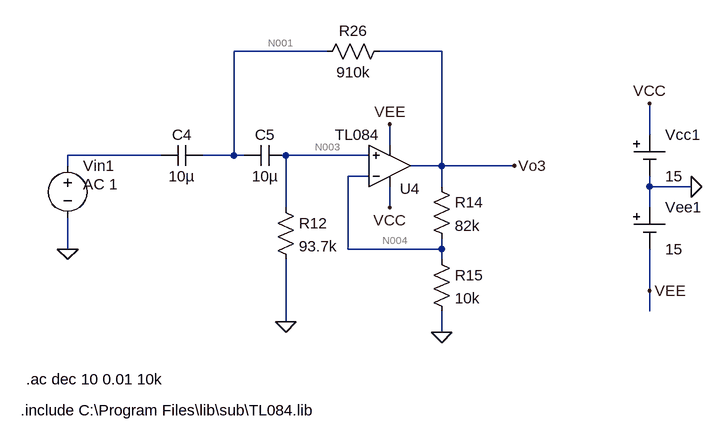
[diagram p0: schematic HPF.asc]
HPF.asc, the LTspice schematic file:
Version 4
SHEET 1 2944 1664
WIRE -768 -304 -912 -304
WIRE -592 -304 -688 -304
WIRE -272 -176 -272 -224
WIRE -672 -160 -672 -192
WIRE -1024 -144 -1168 -144
WIRE -912 -144 -912 -304
WIRE -912 -144 -960 -144
WIRE -896 -144 -912 -144
WIRE -704 -144 -832 -144
WIRE -1168 -128 -1168 -144
WIRE -592 -128 -592 -304
WIRE -592 -128 -640 -128
WIRE -480 -128 -592 -128
WIRE -704 -112 -736 -112
WIRE -592 -96 -592 -128
WIRE -272 -96 -272 -112
WIRE -208 -96 -272 -96
WIRE -832 -64 -832 -144
WIRE -672 -64 -672 -96
WIRE -272 -64 -272 -96
WIRE -1168 0 -1168 -48
WIRE -736 0 -736 -112
WIRE -592 0 -592 -16
WIRE -592 0 -736 0
WIRE -592 16 -592 0
WIRE -272 64 -272 0
WIRE -272 96 -272 64
WIRE -832 112 -832 16
WIRE -592 128 -592 96
FLAG -208 -96 0
FLAG -272 -224 VCC
FLAG -272 64 VEE
FLAG -1168 0 0
FLAG -832 112 0
FLAG -592 128 0
FLAG -672 -192 VEE
FLAG -672 -64 VCC
FLAG -480 -128 Vo3
SYMBOL Misc\\cell -272 -176 R0
SYMATTR InstName Vcc1
SYMATTR Value 15
SYMBOL Misc\\cell -272 -64 R0
SYMATTR InstName Vee1
SYMATTR Value 15
SYMBOL voltage -1168 -144 R0
WINDOW 123 24 44 Left 2
WINDOW 39 0 0 Left 0
SYMATTR Value2 AC 1
SYMATTR InstName Vin1
SYMATTR Value ""
SYMBOL cap -832 -160 R90
WINDOW 0 0 32 VBottom 2
WINDOW 3 32 32 VTop 2
SYMATTR InstName C5
SYMATTR Value 10µ
SYMBOL cap -960 -160 R90
WINDOW 0 0 32 VBottom 2
WINDOW 3 32 32 VTop 2
SYMATTR InstName C4
SYMATTR Value 10µ
SYMBOL res -608 -112 R0
SYMATTR InstName R14
SYMATTR Value 82k
SYMBOL res -608 0 R0
SYMATTR InstName R15
SYMATTR Value 10k
SYMBOL res -672 -320 R90
WINDOW 0 0 56 VBottom 2
WINDOW 3 32 56 VTop 2
SYMATTR InstName R26
SYMATTR Value 910k
SYMBOL Opamps\\opamp2 -672 -64 M180
WINDOW 0 16 29 Left 2
WINDOW 3 -84 112 Left 2
SYMATTR InstName U4
SYMATTR Value TL084
SYMBOL res -848 -80 R0
SYMATTR InstName R12
SYMATTR Value 93.7k
TEXT -1232 200 Left 2 !.ac dec 10 0.01 10k
TEXT -1240 248 Left 2 !.include C:\\Program Files\\lib\\sub\\TL084.lib

The netlist it stands for:
* HPF.asc
Vcc1 VCC 0 15
Vee1 0 VEE 15
Vin1 N002 0 AC 1
C5 N003 N001 10µ
C4 N001 N002 10µ
R14 Vo3 N004 82k
R15 N004 0 10k
R26 Vo3 N001 910k
XU4 N003 N004 VCC VEE Vo3 TL084  ; pins In+ In- V+ V- OUT
R12 N003 0 93.7k
.ac dec 10 0.01 10k
.include C:\Program Files\lib\sub\TL084.lib
.backanno
.end

* Results of the author's LTspice run, read from the files saved beside the schematic
* Operating Point, zero values left out:
*   V(vcc) = 15 V
*   V(vee) = -15 V
*   V(n003) = -4.221 µV
*   V(n001) = 65.79 µV
*   V(vo3) = 65.79 µV
*   V(n004) = 6.749 µV
*   I(R12) = -45.05 pA
*   I(R15) = 674.9 pA
*   I(R14) = 720 pA
*   I(Vee1) = -14.19 mA
*   I(Vcc1) = -14.19 mA
*   Ix(u4:1) = 45.05 pA
*   Ix(u4:2) = 45.05 pA
*   Ix(u4:3) = 14.19 mA
*   Ix(u4:4) = -14.19 mA
*   Ix(u4:5) = -720 pA
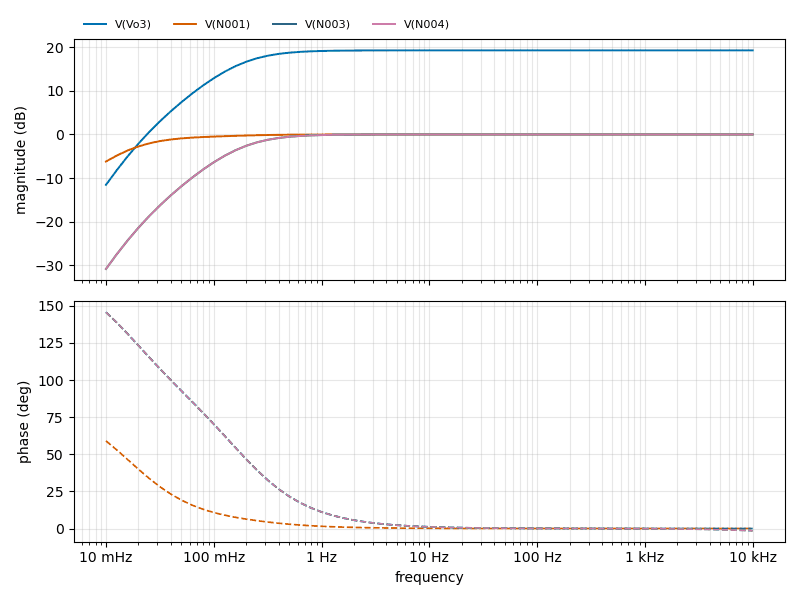
[diagram p1: AC Analysis of HPF.asc, plotted from the saved traces]
* AC Analysis, 1 run:
*   V(Vo3): -11.55 dB at 10 mHz, 19.27 dB at 10 kHz, peak 19.28 dB at 251.2 Hz, 3 dB below the peak at 182.5 mHz
*   V(N001): -6.21 dB at 10 mHz, -0.00 dB at 10 kHz, peak -0.00 dB at 10 kHz, 3 dB below the peak at 18.73 mHz
*   V(N003): -30.83 dB at 10 mHz, -0.00 dB at 10 kHz, peak -0.00 dB at 10 kHz, 3 dB below the peak at 182.5 mHz
*   V(N004): -30.83 dB at 10 mHz, -0.00 dB at 10 kHz, peak -0.00 dB at 251.2 Hz, 3 dB below the peak at 182.5 mHz